# Altium schematic sheet 八进八出.SchDoc: 阿波罗八进八出控制器
size A4; Revision: V1.2; SheetNumber: 0; SheetTotal: 0
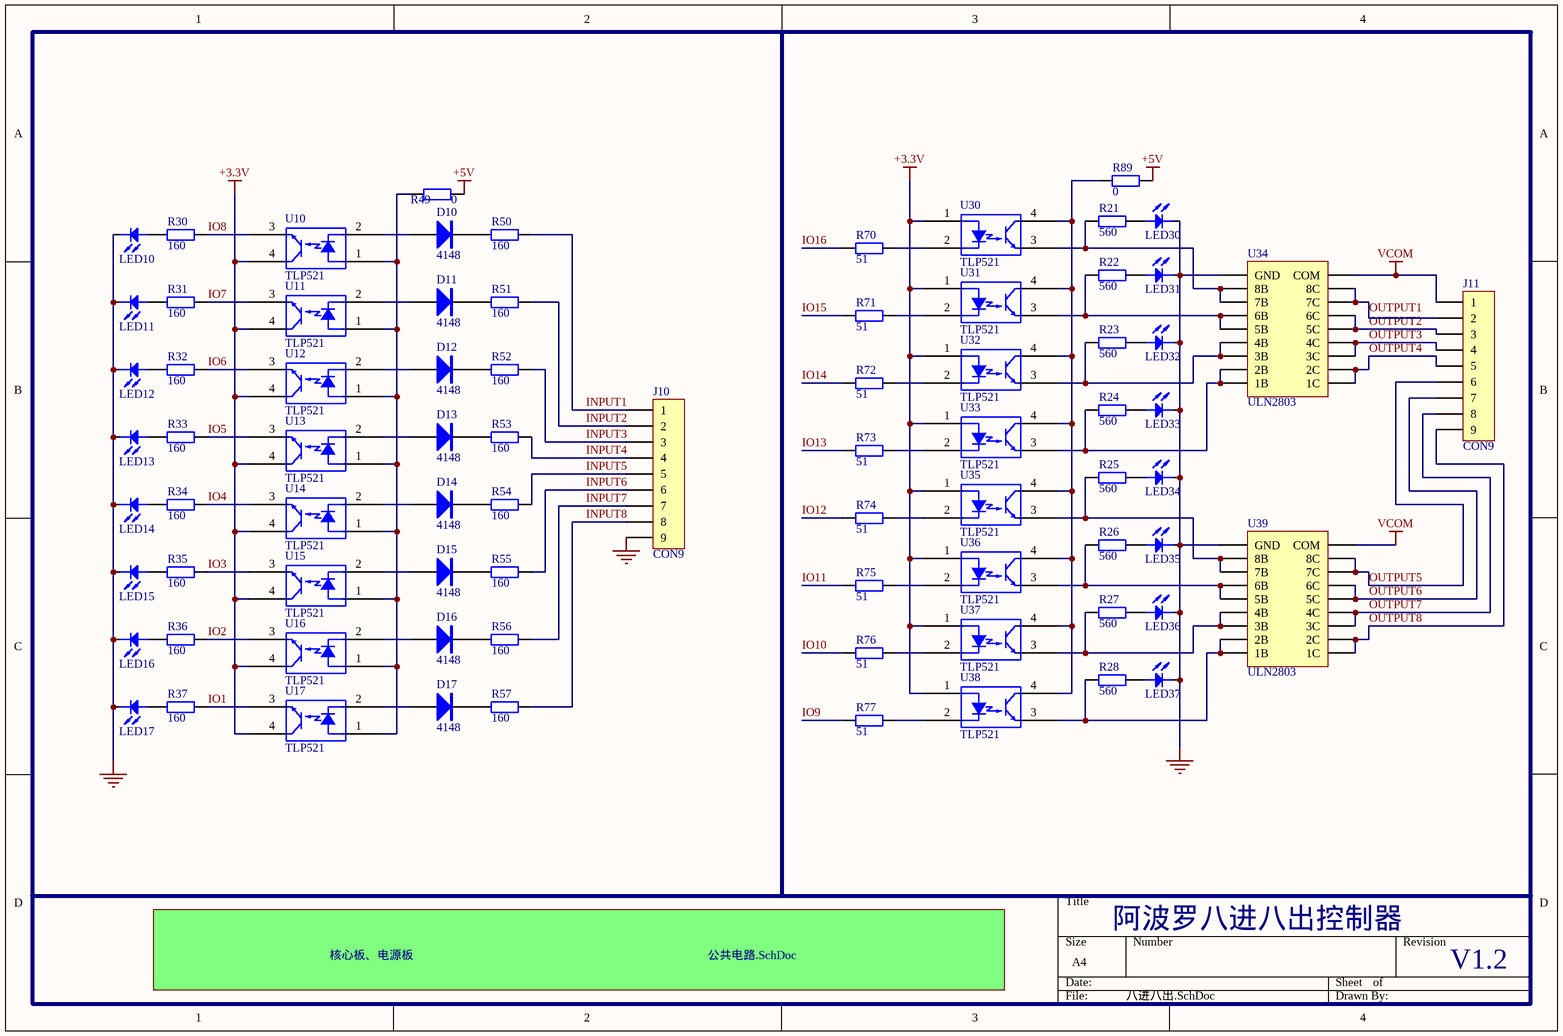
[diagram p0: 八进八出.SchDoc]

## Parts
D10  4148  [贴片二极管]
D11  4148  [贴片二极管]
D12  4148  [贴片二极管]
D13  4148  [贴片二极管]
D14  4148  [贴片二极管]
D15  4148  [贴片二极管]
D16  4148  [贴片二极管]
D17  4148  [贴片二极管]
J10  CON9  [CON9-5.1卧]
J11  CON9  [CON9-5.1卧]
LED10  LED  [LED2.5]  (value not drawn)
LED11  LED  [LED2.5]  (value not drawn)
LED12  LED  [LED2.5]  (value not drawn)
LED13  LED  [LED2.5]  (value not drawn)
LED14  LED  [LED2.5]  (value not drawn)
LED15  LED  [LED2.5]  (value not drawn)
LED16  LED  [LED2.5]  (value not drawn)
LED17  LED  [LED2.5]  (value not drawn)
LED30  LED  [LED2.5]  (value not drawn)
LED31  LED  [LED2.5]  (value not drawn)
LED32  LED  [LED2.5]  (value not drawn)
LED33  LED  [LED2.5]  (value not drawn)
LED34  LED  [LED2.5]  (value not drawn)
LED35  LED  [LED2.5]  (value not drawn)
LED36  LED  [LED2.5]  (value not drawn)
LED37  LED  [LED2.5]  (value not drawn)
R21  560  [0603A]
R22  560  [0603A]
R23  560  [0603A]
R24  560  [0603A]
R25  560  [0603A]
R26  560  [0603A]
R27  560  [0603A]
R28  560  [0603A]
R30  160  [0603A]
R31  160  [0603A]
R32  160  [0603A]
R33  160  [0603A]
R34  160  [0603A]
R35  160  [0603A]
R36  160  [0603A]
R37  160  [0603A]
R49  0  [0603A]
R50  160  [0603A]
R51  160  [0603A]
R52  160  [0603A]
R53  160  [0603A]
R54  160  [0603A]
R55  160  [0603A]
R56  160  [0603A]
R57  160  [0603A]
R70  51  [0603A]
R71  51  [0603A]
R72  51  [0603A]
R73  51  [0603A]
R74  51  [0603A]
R75  51  [0603A]
R76  51  [0603A]
R77  51  [0603A]
R89  0  [0603A]
U10  TLP521  [PC817]
U11  TLP521  [PC817]
U12  TLP521  [PC817]
U13  TLP521  [PC817]
U14  TLP521  [PC817]
U15  TLP521  [PC817]
U16  TLP521  [PC817]
U17  TLP521  [PC817]
U30  TLP521  [PC817]
U31  TLP521  [PC817]
U32  TLP521  [PC817]
U33  TLP521  [PC817]
U34  ULN2803  [sol18]
U35  TLP521  [PC817]
U36  TLP521  [PC817]
U37  TLP521  [PC817]
U38  TLP521  [PC817]
U39  ULN2803  [sol18]

## Sub-sheets
核心板、电源板 = 公共电路.SchDoc: no entries

## Nets
+3.3V: U10.4(COL) U11.4(COL) U12.4(COL) U13.4(COL) U14.4(COL) U15.4(COL) U16.4(COL) U17.4(COL) U30.1(ANODE) U31.1(ANODE) U32.1(ANODE) U33.1(ANODE) U35.1(ANODE) U36.1(ANODE) U37.1(ANODE) U38.1(ANODE)
+5V: R49.2 R89.2
GND: J10.9 LED10.K LED11.K LED12.K LED13.K LED14.K LED15.K LED16.K LED17.K LED30.K LED31.K LED32.K LED33.K LED34.K LED35.K LED36.K LED37.K U34.9(GND) U39.9(GND)
VCOM: J11.1 U34.10(COM) U39.10(COM)
INPUT1: J10.1 R50.2
INPUT2: J10.2 R51.2
INPUT3: J10.3 R52.2
INPUT4: J10.4 R53.2
INPUT5: J10.5 R54.2
INPUT6: J10.6 R55.2
INPUT7: J10.7 R56.2
INPUT8: J10.8 R57.2
IO1: R37.1 U17.3(EMIT)
IO2: R36.1 U16.3(EMIT)
IO3: R35.1 U15.3(EMIT)
IO4: R34.1 U14.3(EMIT)
IO5: R33.1 U13.3(EMIT)
IO6: R32.1 U12.3(EMIT)
IO7: R31.1 U11.3(EMIT)
IO8: R30.1 U10.3(EMIT)
IO9: R77.1
IO10: R76.1
IO11: R75.1
IO12: R74.1
IO13: R73.1
IO14: R72.1
IO15: R71.1
IO16: R70.1
OUTPUT1: J11.2 U34.11(8C) U34.12(7C)
OUTPUT2: J11.3 U34.13(6C) U34.14(5C)
OUTPUT3: J11.4 U34.15(4C) U34.16(3C)
OUTPUT4: J11.5 U34.17(2C) U34.18(1C)
OUTPUT5: J11.6 U39.11(8C) U39.12(7C)
OUTPUT6: J11.7 U39.13(6C) U39.14(5C)
OUTPUT7: J11.8 U39.15(4C) U39.16(3C)
OUTPUT8: J11.9 U39.17(2C) U39.18(1C)
NetD10_A: D10.A U10.2(CATH)
NetD10_K: D10.K R50.1
NetD11_A: D11.A U11.2(CATH)
NetD11_K: D11.K R51.1
NetD12_A: D12.A U12.2(CATH)
NetD12_K: D12.K R52.1
NetD13_A: D13.A U13.2(CATH)
NetD13_K: D13.K R53.1
NetD14_A: D14.A U14.2(CATH)
NetD14_K: D14.K R54.1
NetD15_A: D15.A U15.2(CATH)
NetD15_K: D15.K R55.1
NetD16_A: D16.A U16.2(CATH)
NetD16_K: D16.K R56.1
NetD17_A: D17.A U17.2(CATH)
NetD17_K: D17.K R57.1
NetLED10_A: LED10.A R30.2
NetLED11_A: LED11.A R31.2
NetLED12_A: LED12.A R32.2
NetLED13_A: LED13.A R33.2
NetLED14_A: LED14.A R34.2
NetLED15_A: LED15.A R35.2
NetLED16_A: LED16.A R36.2
NetLED17_A: LED17.A R37.2
NetLED30_A: LED30.A R21.2
NetLED31_A: LED31.A R22.2
NetLED32_A: LED32.A R23.2
NetLED33_A: LED33.A R24.2
NetLED34_A: LED34.A R25.2
NetLED35_A: LED35.A R26.2
NetLED36_A: LED36.A R27.2
NetLED37_A: LED37.A R28.2
NetR21_1: R21.1 U30.3(EMIT) U34.7(7B) U34.8(8B)
NetR22_1: R22.1 U31.3(EMIT) U34.5(5B) U34.6(6B)
NetR23_1: R23.1 U32.3(EMIT) U34.3(3B) U34.4(4B)
NetR24_1: R24.1 U33.3(EMIT) U34.1(1B) U34.2(2B)
NetR25_1: R25.1 U35.3(EMIT) U39.7(7B) U39.8(8B)
NetR26_1: R26.1 U36.3(EMIT) U39.5(5B) U39.6(6B)
NetR27_1: R27.1 U37.3(EMIT) U39.3(3B) U39.4(4B)
NetR28_1: R28.1 U38.3(EMIT) U39.1(1B) U39.2(2B)
NetR49_1: R49.1 U10.1(ANODE) U11.1(ANODE) U12.1(ANODE) U13.1(ANODE) U14.1(ANODE) U15.1(ANODE) U16.1(ANODE) U17.1(ANODE)
NetR70_2: R70.2 U30.2(CATH)
NetR71_2: R71.2 U31.2(CATH)
NetR72_2: R72.2 U32.2(CATH)
NetR73_2: R73.2 U33.2(CATH)
NetR74_2: R74.2 U35.2(CATH)
NetR75_2: R75.2 U36.2(CATH)
NetR76_2: R76.2 U37.2(CATH)
NetR77_2: R77.2 U38.2(CATH)
NetR89_1: R89.1 U30.4(COL) U31.4(COL) U32.4(COL) U33.4(COL) U35.4(COL) U36.4(COL) U37.4(COL) U38.4(COL)

## Library data of the parts
D10-D17 = 二极管
R21-R28 R30-R37 R49-R57 R70-R77 R89 = Res2: Resistor; Value: 1K; Published: 8-Jun-2000; LatestRevisionDate: 17-Jul-2002; LatestRevisionNote: Re-released for DXP Platform.; PackageReference: AXIAL-0.4; Publisher: Altium Limited
U10-U17 U30-U33 U35-U38 = TLP521-1: Single NPN PhotoTransistor OptoCoupler.